# EAGLE schematic main_V1 (EAGLE 8.5.1)

## Sheet 1 of 6: ESP-12E Main
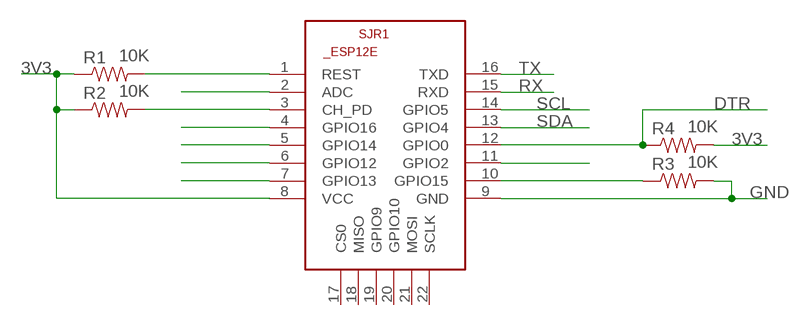
[diagram p0: schematic, sheet 1]

### Parts
R1  10K  RESISTOR1206  [1206]
R2  10K  RESISTOR1206  [1206]
R3  10K  RESISTOR1206  [1206]
R4  10K  RESISTOR1206  [1206]
SJR1  ESP8266-12EESP12E  [ESP8266-ESP12E]

### Nets
3V3: R1.1 R2.1 R4.2 SJR1.8(VCC) ; also sheet 2,4
DTR: R4.1 SJR1.12(GPIO0)
GND: R3.2 SJR1.9(GND) ; also sheet 2,3,4
N$1: R1.2 SJR1.1(REST)
N$2: R2.2 SJR1.3(CH_PD)
N$4: R3.1 SJR1.10(GPIO15)
N$8: SJR1.2(ADC)
N$9: SJR1.4(GPIO16)
N$10: SJR1.5(GPIO14)
N$11: SJR1.6(GPIO12)
N$12: SJR1.7(GPIO13)
N$15: SJR1.11(GPIO2)
RX: SJR1.15(RXD)
SCL: SJR1.14(GPIO5) ; also sheet 2
SDA: SJR1.13(GPIO4) ; also sheet 2
TX: SJR1.16(TXD)
Unconnected: SJR1.17(CS0) SJR1.18(MISO) SJR1.19(GPIO9) SJR1.20(GPIO10) SJR1.21(MOSI) SJR1.22(SCLK)

## Sheet 2 of 6: I2C IO Extender
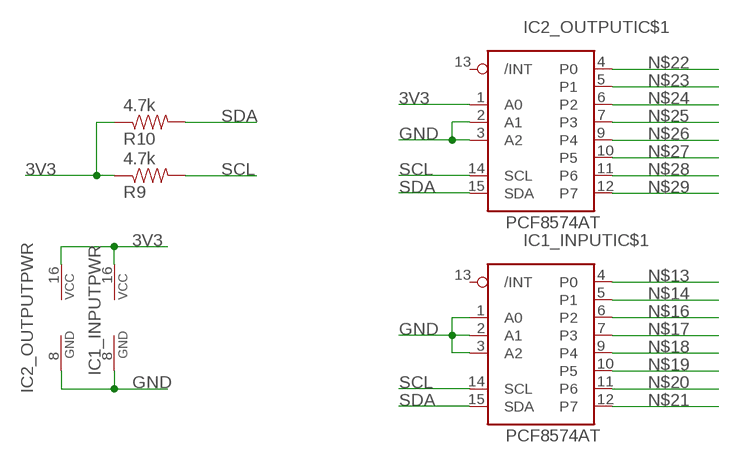
[diagram p1: schematic, sheet 2]

### Parts
IC1_INPUT  PCF8574AT  [SO16]
IC2_OUTPUT  PCF8574AT  [SO16]
R9  4.7k  RESISTOR1206  [1206]
R10  4.7k  RESISTOR1206  [1206]

### Nets
3V3: IC1_INPUT.16(PWR:VCC) IC2_OUTPUT.1(IC$1:A0) IC2_OUTPUT.16(PWR:VCC) R9.1 R10.1 ; also sheet 1,4
GND: IC1_INPUT.1(IC$1:A0) IC1_INPUT.2(IC$1:A1) IC1_INPUT.3(IC$1:A2) IC1_INPUT.8(PWR:GND) IC2_OUTPUT.2(IC$1:A1) IC2_OUTPUT.3(IC$1:A2) IC2_OUTPUT.8(PWR:GND) ; also sheet 1,3,4
N$13: IC1_INPUT.4(IC$1:P0)
N$14: IC1_INPUT.5(IC$1:P1)
N$16: IC1_INPUT.6(IC$1:P2)
N$17: IC1_INPUT.7(IC$1:P3)
N$18: IC1_INPUT.9(IC$1:P4)
N$19: IC1_INPUT.10(IC$1:P5)
N$20: IC1_INPUT.11(IC$1:P6)
N$21: IC1_INPUT.12(IC$1:P7)
N$22: IC2_OUTPUT.4(IC$1:P0)
N$23: IC2_OUTPUT.5(IC$1:P1)
N$24: IC2_OUTPUT.6(IC$1:P2)
N$25: IC2_OUTPUT.7(IC$1:P3)
N$26: IC2_OUTPUT.9(IC$1:P4)
N$27: IC2_OUTPUT.10(IC$1:P5)
N$28: IC2_OUTPUT.11(IC$1:P6)
N$29: IC2_OUTPUT.12(IC$1:P7)
SCL: IC1_INPUT.14(IC$1:SCL) IC2_OUTPUT.14(IC$1:SCL) R9.2 ; also sheet 1
SDA: IC1_INPUT.15(IC$1:SDA) IC2_OUTPUT.15(IC$1:SDA) R10.2 ; also sheet 1
Unconnected: IC1_INPUT.13(IC$1:/INT) IC2_OUTPUT.13(IC$1:/INT)

## Sheet 3 of 6: Lio-Ion Charging
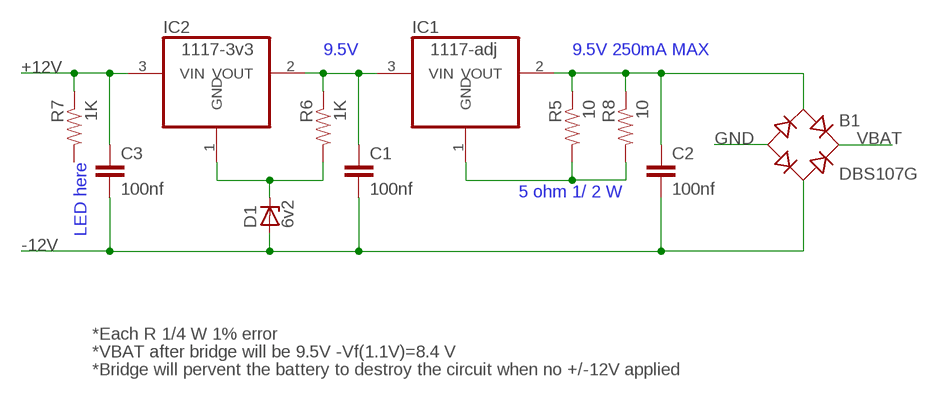
[diagram p2: schematic, sheet 3]

### Parts
B1  DBS107G  [DBS]
C1  100nf  C-EUC1206K  [C1206K]
C2  100nf  C-EUC1206K  [C1206K]
C3  100nf  C-EUC1206K  [C1206K]
D1  6v2  ZENER-DIODESOT23  [SOT23]
IC1  1117-adj  REG1117  [SOT223]
IC2  1117-3v3  REG1117  [SOT223]
R5  10  RESISTOR1206  [1206]
R6  1K  RESISTOR1206  [1206]
R7  1K  RESISTOR1206  [1206]
R8  10  RESISTOR1206  [1206]

### Nets
+12V: C3.1 IC2.3(VIN) R7.1
-12V: B1.AC2 C1.2 C2.2 C3.2 D1.1(A)
GND: B1.- ; also sheet 1,2,4
N$3: D1.3(C) IC2.1(GND) R6.2
N$5: IC1.1(GND) R5.2 R8.2
N$6: B1.AC1 C2.1 IC1.2(VOUT) R5.1 R8.1
N$7: C1.1 IC1.3(VIN) IC2.2(VOUT) R6.1
VBAT: B1.+ ; also sheet 4
Unconnected: R7.2

### Notes on the sheet
- 9.5V | 9.5V 250mA MAX
- LED here
- 5 ohm 1/ 2 W
- *Each R 1/4 W 1% error
- *VBAT after bridge will be 9.5V -Vf(1.1V)=8.4 V
- *Bridge will pervent the battery to destroy the circuit when no +/-12V applied

## Sheet 4 of 6: power manegment
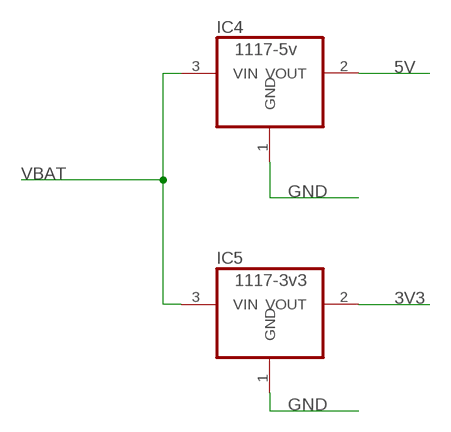
[diagram p3: schematic, sheet 4]

### Parts
IC4  1117-5v  REG1117  [SOT223]
IC5  1117-3v3  REG1117  [SOT223]

### Nets
3V3: IC5.2(VOUT) ; also sheet 1,2
5V: IC4.2(VOUT)
GND: IC4.1(GND) IC5.1(GND) ; also sheet 1,2,3
VBAT: IC4.3(VIN) IC5.3(VIN) ; also sheet 3

## Sheet 5 of 6: Analog Multiplexer
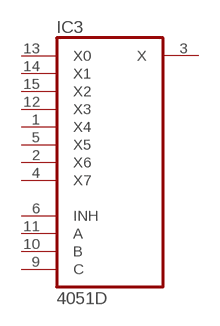
[diagram p4: schematic, sheet 5]

### Parts
IC3  4051D  [SO16]
Unconnected: IC3.1(X4) IC3.2(X6) IC3.3(X) IC3.4(X7) IC3.5(X5) IC3.6(INH) IC3.9(C) IC3.10(B) IC3.11(A) IC3.12(X3) IC3.13(X0) IC3.14(X1) IC3.15(X2)

## Sheet 6 of 6: DC Motor interface

## Power pins joined to a net without a drawn wire
GND: IC3.8(GND)
VCC: IC3.16(VCC)
VEE: IC3.7(VEE)

## Library data of the parts
B1 = rectifier:DB?*G: Single Phase 1.0 AMP Glass Passivated Bridge Rectifier Taiwan Semiconductor Co.,Ltd. - TSC Source: http://www.taiwansemi.com/TSCbig5/ezcatfiles/cust/img/img/db101g.pdf http://www.ts.com.tw/db/pictures/modules/PDT/PDT060207001/DBLS201G.pdf
C1-C3 = rcl:C-EU: CAPACITOR, European symbol; SPICEPREFIX: C
D1 = diode:ZENER-DIODE: Z-Diode
IC1 IC2 IC4 IC5 = burr-brown:REG1117: 800mA and 1A Low Dropout (LDO) Positive Regulator 1.8V, 2.5V, 2.85V, 3.3V, 5V, and Adj; MPN: REG1117; OC_FARNELL: 1097566; OC_NEWARK: 14P6981
IC1_INPUT IC2_OUTPUT = i2c:PCF8574: Remote 8-Bit I/O Expander for I²C Bus
IC3 = 40xx:4051: 8-channel ANALOG MULTIPLEXER
R1-R10 = SparkFun:RESISTOR: Resistor Basic schematic elements and footprints for 0603, 1206, and PTH 1/10th watt (small) resistors.
SJR1 = esp12e:ESP8266-12E: ESP8266-12E Library for Eagle CAD The author not responsible for any damages or errors!. Created by Suhail jr.lt;/author>